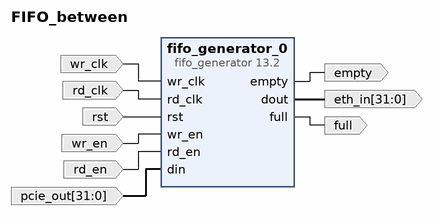
[diagram p0: block diagram of the top level]
# Vivado block design FIFO_between, xcku040-ffva1156-2-e, Vivado 2017.4
create_bd_design FIFO_between

create_bd_port -dir I -type clk wr_clk
create_bd_port -dir I -type clk rd_clk
create_bd_port -dir I rst
create_bd_port -dir I wr_en
create_bd_port -dir I rd_en
create_bd_port -dir I -from 31 -to 0 -type data pcie_out
create_bd_port -dir O -from 31 -to 0 -type data eth_in
create_bd_port -dir O empty
create_bd_port -dir O full

create_bd_cell -type ip -vlnv xilinx.com:ip:fifo_generator:13.2 fifo_generator_0
set_property -dict [list \
  CONFIG.Fifo_Implementation Independent_Clocks_Block_RAM \
  CONFIG.Input_Data_Width 32 \
  CONFIG.Use_Embedded_Registers false \
  CONFIG.Full_Flags_Reset_Value 1 \
  CONFIG.Enable_Safety_Circuit true \
] [get_bd_cells fifo_generator_0]

# ---- connections ----

connect_bd_net [get_bd_ports wr_clk] [get_bd_pins fifo_generator_0/wr_clk]
connect_bd_net [get_bd_ports rd_clk] [get_bd_pins fifo_generator_0/rd_clk]
connect_bd_net [get_bd_ports rst] [get_bd_pins fifo_generator_0/rst]
connect_bd_net [get_bd_ports wr_en] [get_bd_pins fifo_generator_0/wr_en]
connect_bd_net [get_bd_ports rd_en] [get_bd_pins fifo_generator_0/rd_en]
connect_bd_net [get_bd_ports pcie_out] [get_bd_pins fifo_generator_0/din]
connect_bd_net [get_bd_pins fifo_generator_0/dout] [get_bd_ports eth_in]
connect_bd_net [get_bd_pins fifo_generator_0/empty] [get_bd_ports empty]
connect_bd_net [get_bd_pins fifo_generator_0/full] [get_bd_ports full]

validate_bd_design
save_bd_design
